# Altium project P-FTINT-2-0.PrjPCB
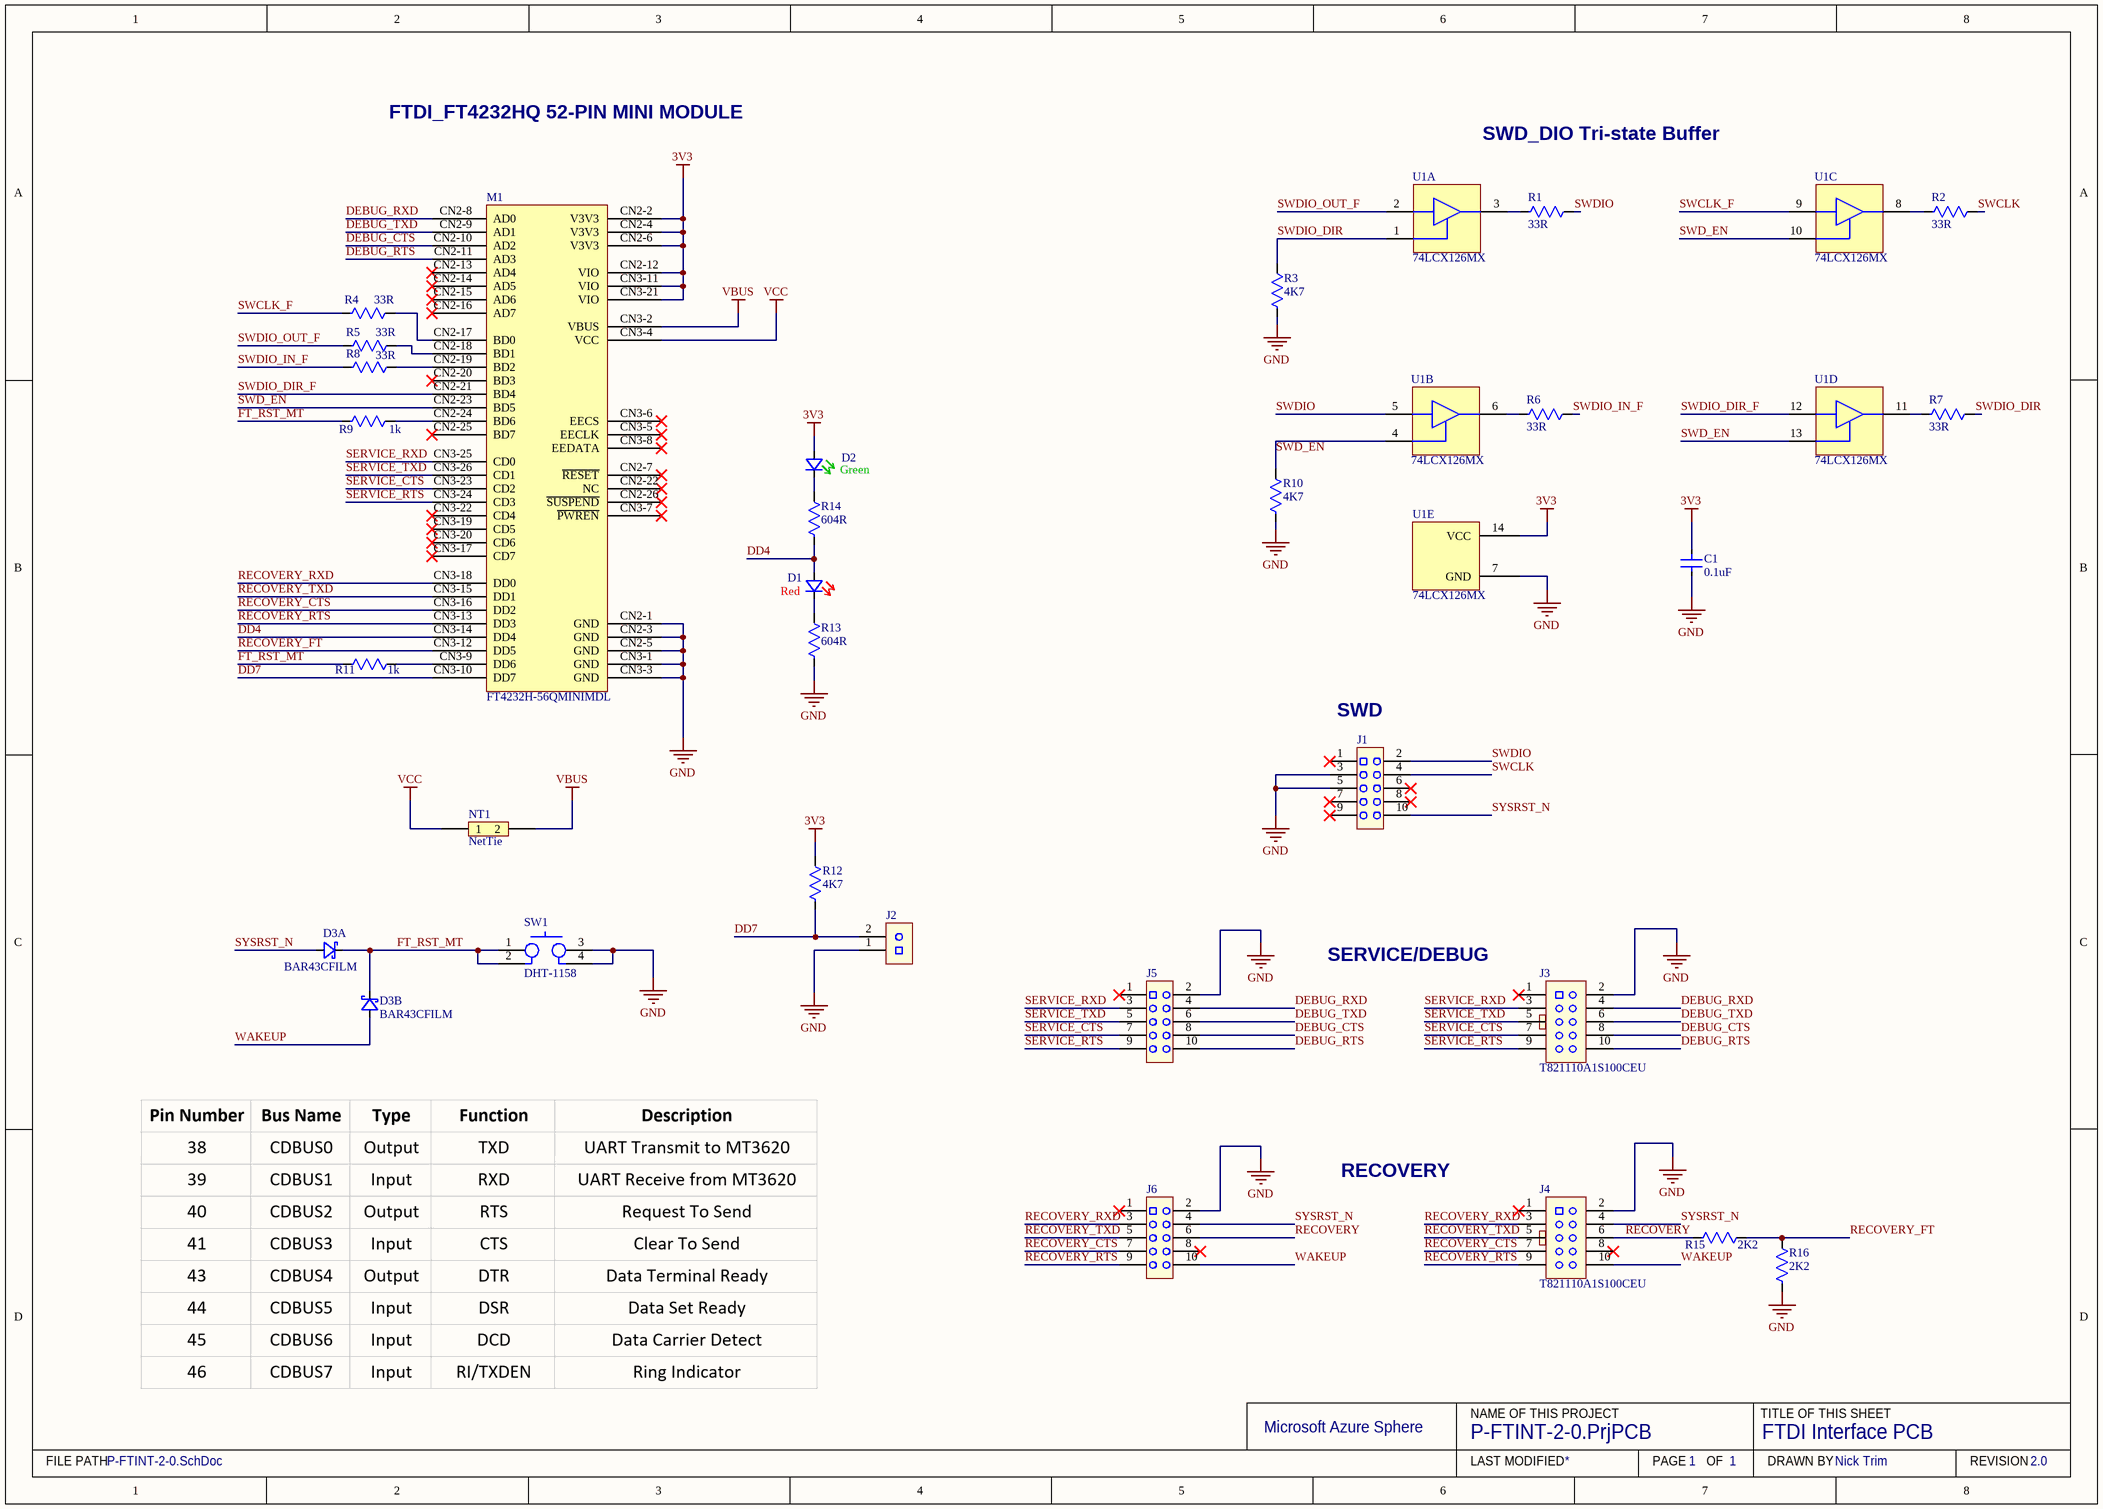
[diagram p0: P-FTINT-2-0.SchDoc]
1 sheet, 30 parts. Net scope: global (net labels, ports and power ports of the same name join across sheets).
Board file: P-FTINT-2-0.PcbDoc

## Sheet P-FTINT-2-0.SchDoc: FTDI Interface PCB
size A3; DrawnBy: Nick Trim; Revision: 2.0; SheetNumber: 1; SheetTotal: 1

### Parts
C1  0.1uF  [CAP 0603 (1608) x 1.2mm]
D1  Colour: Red  [Rohm SML-D12 Red]  (hidden comment: SML-D12U)
D2  Colour: Green  [Rohm SML-D12 Green]  (hidden comment: SML-D12P)
D3  BAR43CFILM  [ON_SEMI-SOT23-3]  (parts A,B of 2)
J1  FTSH-105-01-F-DV-K  [SAMTEC-FTSH-105-01-X-DV-K]  (value not drawn)
J2  MOLEX-0022284020  [0022284020]  (value not drawn)
J3  T821110A1S100CEU  [10 Way shrouded IDC hdr]
J4  T821110A1S100CEU  [10 Way shrouded IDC hdr]
J5  FTSH-105-01-F-DV-K  [SAMTEC-FTSH-105-01-X-DV-K]  (value not drawn)
J6  FTSH-105-01-F-DV-K  [SAMTEC-FTSH-105-01-X-DV-K]  (value not drawn)
M1  FT4232H-56QMINIMDL  [FT4232H-56Q]
NT1  NetTie  [NetTie]  (net tie, no BOM)
R1  33R  [RES0603]
R2  33R  [RES0603]
R3  4K7  [RES0603]
R4  33R  [RES0603]
R5  33R  [RES0603]
R6  33R  [RES0603]
R7  33R  [RES0603]
R8  33R  [RES0603]
R9  Resistance: 1k  [RES0603]  (hidden comment: ERJ-PA3J102V)
R10  4K7  [RES0603]
R11  Resistance: 1k  [RES0603]  (hidden comment: ERJ-PA3J102V)
R12  4K7  [RES0603]
R13  604R  [RES0603]
R14  604R  [RES0603]
R15  2K2  [RES0603]
R16  2K2  [RES0603]
SW1  DHT-1158  [DHT-1158]
U1  74LCX126MX  [74LCX126MX]  (parts A,B,C,D,E of 5)

### Nets
3V3: C1.2 D2.2(A) M1.CN2-2(V3V3) M1.CN2-4(V3V3) M1.CN2-6(V3V3) M1.CN2-12(VIO) M1.CN3-11(VIO) M1.CN3-21(VIO) R12.1 U1.14(VCC)
GND: C1.1 J1.3 J1.5 J2.1 J3.2 J4.2 J5.2 J6.2 M1.CN2-1(GND) M1.CN2-3(GND) M1.CN2-5(GND) M1.CN3-1(GND) M1.CN3-3(GND) R3.2 R10.2 R13.2 R16.2 SW1.3 SW1.4 U1.7(GND)
VBUS: M1.CN3-2(VBUS) NT1.2
VCC: M1.CN3-4(VCC) NT1.1
DD4: D1.2(A) M1.CN3-14(DD4) R14.2
DD7: J2.2 M1.CN3-10(DD7) R12.2
DEBUG_CTS: J3.8 J5.8 M1.CN2-10(AD2)
DEBUG_RTS: J3.10 J5.10 M1.CN2-11(AD3)
DEBUG_RXD: J3.4 J5.4 M1.CN2-8(AD0)
DEBUG_TXD: J3.6 J5.6 M1.CN2-9(AD1)
FT_RST_MT: D3.3(K) R9.2 R11.2 SW1.1 SW1.2
RECOVERY: J4.6 J6.6 R15.2
RECOVERY_CTS: J4.7 J6.7 M1.CN3-16(DD2)
RECOVERY_FT: M1.CN3-12(DD5) R15.1 R16.1
RECOVERY_RTS: J4.9 J6.9 M1.CN3-13(DD3)
RECOVERY_RXD: J4.3 J6.3 M1.CN3-18(DD0)
RECOVERY_TXD: J4.5 J6.5 M1.CN3-15(DD1)
SERVICE_CTS: J3.7 J5.7 M1.CN3-23(CD2)
SERVICE_RTS: J3.9 J5.9 M1.CN3-24(CD3)
SERVICE_RXD: J3.3 J5.3 M1.CN3-25(CD0)
SERVICE_TXD: J3.5 J5.5 M1.CN3-26(CD1)
SWCLK: J1.4 R2.1
SWCLK_F: R4.2 U1.9(3A)
SWD_EN: M1.CN2-23(BD5) R10.1 U1.4(2OE) U1.10(3OE) U1.13(4OE)
SWDIO: J1.2 R1.1 U1.5(2A)
SWDIO_DIR: R3.1 R7.1 U1.1(1OE)
SWDIO_DIR_F: M1.CN2-21(BD4) U1.12(4A)
SWDIO_IN_F: R6.1 R8.2
SWDIO_OUT_F: R5.2 U1.2(1A)
SYSRST_N: D3.1(A1) J1.10 J4.4 J6.4
WAKEUP: D3.2(A2) J4.10 J6.10
NetD1_1: D1.1(K) R13.1
NetD2_1: D2.1(K) R14.1
NetM1_CN2-17: M1.CN2-17(BD0) R4.1
NetM1_CN2-18: M1.CN2-18(BD1) R5.1
NetM1_CN2-19: M1.CN2-19(BD2) R8.1
NetM1_CN2-24: M1.CN2-24(BD6) R9.1
NetM1_CN3-9: M1.CN3-9(DD6) R11.1
NetR1_2: R1.2 U1.3(1Y)
NetR2_2: R2.2 U1.8(3Y)
NetR6_2: R6.2 U1.6(2Y)
NetR7_2: R7.2 U1.11(4Y)

Not connected (* = marked no-connect by the designer): J1 1* 6* 7* 8* 9*; J3 1*; J4 1* 8*; J5 1*; J6 1* 8*; M1 CN2-7(~{RESET})* CN2-13(AD4)* CN2-14(AD5)* CN2-15(AD6)* CN2-16(AD7)* CN2-20(BD3)* CN2-22(NC)* CN2-25(BD7)* CN2-26(~{SUSPEND})* CN3-5(EECLK)* CN3-6(EECS)* CN3-7(~{PWREN})* CN3-8(EEDATA)* CN3-17(CD7)* CN3-19(CD5)* CN3-20(CD6)* CN3-22(CD4)*

### Notes on the sheet
- FTDI_FT4232HQ 52-PIN MINI MODULE
- SWD_DIO Tri-state Buffer
- (near J1) SWD
- SERVICE/DEBUG
- RECOVERY
- Microsoft Azure Sphere
- NAME OF THIS PROJECT
- TITLE OF THIS SHEET
- FILE PATH
- LAST MODIFIED
- PAGE
- OF
- DRAWN BY
- REVISION

### Library data of the parts
C1 = CGA3E2X7R1E104K080AA: CAP CER 0.1UF 25V X7R 0603; Manufacturer: TDK; Capacitance: 100nF; Tolerance: 10%; Supplier 1: Digi-Key; Manufacturer Part Number: CGA3E2X7R1E104K080AA; Stock 1: 1795818; Pricing 1: 1=0.1, 10=0.057, 100=0.0253, 500=0.0181, 1000=0.01422 (USD); Mount: Surface Mount; Case/Package: 0603; Weight: 7.1E-05oz; Case Code (Metric): 1608; Case Code (Imperial): 0603; Min Operating Temperature: -55°C; Max Operating Temperature: 125°C; Packaging: Tape and Reel; Package Quantity: 1; Voltage Rating: 25V; Voltage Rating (DC): 25V; Dielectric: X7R; Termination: SMD/SMT; Composition: Ceramic; Length: 1.6mm; Height: 0.8mm; Width: 0.031inch; Thickness: 0.035inch; Depth: 0.8mm; Ratings: AEC-Q200; REACH SVHC: No SVHC; Lead Free: Lead Free; ComponentLink1URL: http://www.farnell.com/datasheets/1735392.pdf?src-supplier=Element14; ComponentLink1Description: http://www.farnell.com/datasheets/1735392.pdf?src-supplier=Element14; ComponentLink2URL: https://product.tdk.com/info/en/documents/chara_sheet/CGA3E2X7R1E104K080AA.pdf?src-supplier=Mouser; ComponentLink2Description: https://product.tdk.com/info/en/documents/chara_sheet/CGA3E2X7R1E104K080AA.pdf?src-supplier=Mouser; ComponentLink3URL: http://product.tdk.com/capacitor/mlcc/en/documents/mlccspec_automotive_general_midvoltage_en.pdf?src-supplier=Future+Electronics; ComponentLink3Description: http://product.tdk.com/capacitor/mlcc/en/documents/mlccspec_automotive_general_midvoltage_en.pdf?src-supplier=Future+Electronics; ComponentLink4URL: http://www.farnell.com/datasheets/1913358.pdf?src-supplier=Newark; ComponentLink4Description: http://www.farnell.com/datasheets/1913358.pdf?src-supplier=Newark; Supplier Part Number 1: 445-5667-1-ND
D1 = SML-D12U: 1.6 x 0.8 x 0.55mm (0603) LED 620nm Red; Manufacturer: Rohm Semiconductor; Manufacturer Part Number: SML-D12U8WT86; Millicandela Rating: 63mcd; Voltage - Forward (Vf) (Typ): 2.2V; Current - Test: 20mA; Lens Type: Diffused, White; Lens Style/Size: Rectangle with Flat Top, 1.2mm x 0.8mm; Supplier 1: Digi-Key; RoHS: RoHS Compliant; Category: Optoelectronics; Stock 1: 5722; Pricing 1: 1=0.38, 10=0.279, 25=0.2232, 100=0.1478, 250=0.1046, 500=0.08926, 1000=0.06974 (GBP); Packaging: Cut Tape (CT); Wavelength - Dominant: 620nm; Wavelength - Peak: -; Viewing Angle: -; Package / Case: 0603 (1608 Metric); Size / Dimension: 1.60mm L x 0.80mm W; Height: 0.55mm; Mounting Type: Surface Mount; Luminous Flux @ Current - Test: -; ComponentLink1URL: http://rohmfs.rohm.com/en/products/databook/datasheet/opto/led/chip_mono/sml-d1.pdf; ComponentLink1Description: http://rohmfs.rohm.com/en/products/databook/datasheet/opto/led/chip_mono/sml-d1.pdf; Supplier 2: Farnell; Supplier Part Number 1: 511-1580-1-ND; Supplier Part Number 2: 1685094
D2 = SML-D12P: 1.6 x 0.8 x 0.55mm (0603) LED 560nm Green; Manufacturer: Rohm Semiconductor; Manufacturer Part Number: SML-D12P8WT86; Millicandela Rating: 6.3mcd; Voltage - Forward (Vf) (Typ): 2.2V; Current - Test: 20mA; Lens Type: Diffused, White; Lens Style/Size: Rectangle with Flat Top, 1.2mm x 0.8mm; Supplier 1: Digi-Key; RoHS: RoHS Compliant; Category: Optoelectronics; Stock 1: 19305; Pricing 1: 1=0.38, 10=0.279, 25=0.2232, 100=0.1478, 250=0.1046, 500=0.08926, 1000=0.06974 (GBP); Packaging: Cut Tape (CT); Wavelength - Dominant: 560nm; Wavelength - Peak: -; Viewing Angle: -; Package / Case: 0603 (1608 Metric); Size / Dimension: 1.60mm L x 0.80mm W; Height: 0.55mm; Mounting Type: Surface Mount; Luminous Flux @ Current - Test: -; ComponentLink1URL: http://rohmfs.rohm.com/en/products/databook/datasheet/opto/led/chip_mono/sml-d1.pdf; ComponentLink1Description: http://rohmfs.rohm.com/en/products/databook/datasheet/opto/led/chip_mono/sml-d1.pdf; Supplier Part Number 1: 511-1579-1-ND
D3 = BAR43CFILM: Small Signal Schottky Diode, Dual Common Cathode, 30 V, 100 mA, 330 mV, 750 mA, 150 °C; Manufacturer: STMicroelectronics; Forward Current: 100mA; Max Reverse Current: 500nA; Forward Voltage: 1V; Max Repetitive Reverse Voltage (Vrrm): 30V; Reverse Recovery Time: 5ns; Max Forward Surge Current (Ifsm): 750mA; Power Dissipation: 250mW; Capacitance: 7pF; Supplier 1: Farnell; Manufacturer Part Number: BAR43CFILM; RoHS: Yes; Category: Rectifier Diodes; Stock 1: 113090; Pricing 1: 5=0.46900, 10=0.31900, 100=0.14900, 500=0.08670, 1000=0.05920 (GBP); Mount: Surface Mount; Case/Package: SOT-23; Number of Pins: 3; Weight: 0.01lb; Contact Plating: Tin,Matte; Min Operating Temperature: -65°C; Max Operating Temperature: 150°C; Element Configuration: Common Cathode; Packaging: Tape and Reel; Package Quantity: 3000; Average Rectified Current: 100mA; Termination: SMD/SMT; Peak Non-Repetitive Surge Current: 750mA; Current Rating: 100mA; Voltage Rating (DC): 30V; Max Reverse Voltage (DC): 30V; Series: BAR43; Length: 2.9mm; Width: 3.05mm; Height: 0.95mm; Radiation Hardening: No; REACH SVHC: No SVHC; Lead Free: Lead Free; RoHS Compliant: Yes; ComponentLink1URL: https://datasheet.ciiva.com/27050/869700-27050546.pdf?src-supplier=Jameco; ComponentLink1Description: https://datasheet.ciiva.com/27050/869700-27050546.pdf?src-supplier=Jameco; ComponentLink2URL: https://datasheet.ciiva.com/1199/1700360-1199952.pdf?src-supplier=Farnell; ComponentLink2Description: https://datasheet.ciiva.com/1199/1700360-1199952.pdf?src-supplier=Farnell; ComponentLink3URL: https://datasheet.ciiva.com/1199/1700360-1199953.pdf?src-supplier=Farnell; ComponentLink3Description: https://datasheet.ciiva.com/1199/1700360-1199953.pdf?src-supplier=Farnell; ComponentLink4URL: https://datasheet.ciiva.com/14558/70013844-14558997.pdf?src-supplier=Allied+Electronics; ComponentLink4Description: https://datasheet.ciiva.com/14558/70013844-14558997.pdf?src-supplier=Allied+Electronics; ComponentLink5URL: https://datasheet.ciiva.com/1177/1837092-1177592.pdf?src-supplier=Element14; ComponentLink5Description: https://datasheet.ciiva.com/1177/1837092-1177592.pdf?src-supplier=Element14; ComponentLink6URL: https://datasheet.ciiva.com/1177/1837092-1177593.pdf?src-supplier=Element14; ComponentLink6Description: https://datasheet.ciiva.com/1177/1837092-1177593.pdf?src-supplier=Element14; ComponentLink7URL: https://datasheet.ciiva.com/905/cd00000764-905866.pdf?src-supplier=Digi-Key; ComponentLink7Description: https://datasheet.ciiva.com/905/cd00000764-905866.pdf?src-supplier=Digi-Key; ComponentLink8URL: https://datasheet.ciiva.com/1177/1700360-1177594.pdf?src-supplier=Element14; ComponentLink8Description: https://datasheet.ciiva.com/1177/1700360-1177594.pdf?src-supplier=Element14; ComponentLink9URL: https://datasheet.ciiva.com/16205/cd00000764-16205466.pdf?src-supplier=Future+Electronics; ComponentLink9Description: https://datasheet.ciiva.com/16205/cd00000764-16205466.pdf?src-supplier=Future+Electronics; ComponentLink10URL: https://datasheet.ciiva.com/905/cd00000764-905867.pdf?src-supplier=Digi-Key; ComponentLink10Description: https://datasheet.ciiva.com/905/cd00000764-905867.pdf?src-supplier=Digi-Key; ComponentLink11URL: https://datasheet.ciiva.com/905/cd00000764-905868.pdf?src-supplier=Digi-Key; ComponentLink11Description: https://datasheet.ciiva.com/905/cd00000764-905868.pdf?src-supplier=Digi-Key; Supplier Part Number 1: 9801383
J1 J5 J6 = FTSH-105-01-F-DV-K: CONN HEADER 10POS DUAL .05" SMD; Manufacturer: Samtec Inc.; Connector Type: Header, Unshrouded; Number of Positions: 10; Number of Positions Loaded: All; Pitch: 0.050" (1.27mm); Supplier 1: Digi-Key; Manufacturer Part Number: FTSH-105-01-F-DV-K; RoHS: RoHS Compliant; Category: Connectors, Interconnects; Stock 1: 13304; Pricing 1: 1=2.26, 10=1.907, 50=1.647, 100=1.4737, 250=1.30032, 500=1.21362, 1000=1.12693, 2500=1.08358, 5000=1.06191 (GBP); Packaging: Tube; Contact Type: Male Pin; Number of Rows: 2; Row Spacing: 0.050" (1.27mm); Contact Mating Length: 0.120" (3.05mm); Mounting Type: Surface Mount; Termination: Solder; Fastening Type: -; Features: Keying Shroud; Contact Finish: Gold; Contact Finish Thickness: 3µin (0.08µm); Color: Black; ComponentLink1URL: http://suddendocs.samtec.com/prints/ftsh-1xx-xx-xxx-dv-xxx-mkt.pdf; ComponentLink1Description: http://suddendocs.samtec.com/prints/ftsh-1xx-xx-xxx-dv-xxx-mkt.pdf; Supplier Part Number 1: SAM8796-ND
J2 = MOLEX-0022284020: CONN HEADER 2POS .100 VERT TIN; Manufacturer: Molex, LLC; Connector Type: Header, Unshrouded, Breakaway; Number of Positions: 2; Number of Positions Loaded: All; Pitch: 0.100" (2.54mm); Supplier 1: Digi-Key; Manufacturer Part Number: 0022284020; RoHS: RoHS Compliant; Category: Connectors, Interconnects; Stock 1: 10077; Pricing 1: 1=0.12, 10=0.108, 25=0.0808, 50=0.0692, 100=0.0668, 250=0.0576, 500=0.0553 (GBP); Packaging: Bulk; Contact Type: Male Pin; Number of Rows: 1; Row Spacing: -; Contact Mating Length: 0.240" (6.10mm); Mounting Type: Through Hole; Termination: Solder; Fastening Type: -; Features: -; Contact Finish: Tin; Contact Finish Thickness: 100µin (2.54µm); Color: Black; ComponentLink1URL: http://www.molex.com/pdm_docs/sd/022284020_sd.pdf; ComponentLink1Description: http://www.molex.com/pdm_docs/sd/022284020_sd.pdf; Supplier Part Number 1: WM50014-02-ND
J3 J4 = T821110A1S100CEU: Conn Shrouded Header HDR 10 POS 2.54mm Solder ST Thru-Hole; Manufacturer: Amphenol; Max Current Rating: 3A; Contact Resistance: 20mR; Number of Contacts: 10; Gender: Male; Supplier 1: Farnell; RoHS: Yes; Category: Connectors; Contact Plating: Gold; Contact Material: Bronze,Brass; Housing Material: Polybutylene; Min Operating Temperature: -40°C; Max Operating Temperature: 105°C; Number of Rows: 2; Termination: Solder; Current Rating: 3A; Orientation: Straight; Packaging: Cut Tape; Series: T821; Length: 20.32mm; Pitch: 2.54mm; Depth: 8.95mm; REACH SVHC: No SVHC; RoHS Compliant: Yes; ComponentLink1URL: https://datasheet.ciiva.com/8045/1846058-8045255.pdf?src-supplier=Element14; ComponentLink1Description: https://datasheet.ciiva.com/8045/1846058-8045255.pdf?src-supplier=Element14; Supplier Part Number 1: 2215304; Manufacturer Part Number: T821110A1S100CEU
M1 = FT4232H-56QMINIMDL: IC MINI MODULE USB/FIFO 56QFN; Manufacturer: FTDI; Supplier 1: Farnell; Manufacturer Part Number: FT4232H-56QMINIMDL; Stock 1: 0; Pricing 1: 1=20.62 (GBP); Case/Package: Module; Min Operating Temperature: -40°C; Max Operating Temperature: 85°C; Packaging: Bulk; Features: I²C; REACH SVHC: No SVHC; Supplier Part Number 1: 2535452
R1 R2 R4-R8 = ERJ-3GEYJ330V: RES SMD 33 OHM 5% 1/10W 0603; Manufacturer: Panasonic; Power Rating: 100mW; Voltage Rating: 75V; Temperature Coefficient: 200ppm/°C; Voltage Rating (DC): 50V; Supplier 1: Digi-Key; Manufacturer Part Number: ERJ-3GEYJ330V; Stock 1: 1457212; Pricing 1: 1=0.1, 10=0.043, 100=0.0176, 1000=0.00791, 2500=0.00686 (USD); Mount: Surface Mount; Case/Package: 0603; Case Code (Imperial): 0603; Case Code (Metric): 1608; Contact Plating: Tin; Min Operating Temperature: -55°C; Max Operating Temperature: 155°C; Tolerance: 5%; Resistance: 33R; Packaging: Tape and Reel; Package Quantity: 1; Termination: SMD/SMT; Composition: Thick Film; Number of Terminations: 2; Military Standard: Not; Max Power Dissipation: 100mW; Features: Automotive AEC-Q200; Length: 1.6mm; Height: 0.45mm; Width: 0.8mm; Depth: 0.8mm; Radiation Hardening: No; REACH SVHC: No SVHC; Lead Free: Lead Free; ComponentLink1URL: http://www.mouser.com/ds/2/315/AOA0000CE1-37422.pdf?src-supplier=Mouser; ComponentLink1Description: http://www.mouser.com/ds/2/315/AOA0000CE1-37422.pdf?src-supplier=Mouser; ComponentLink2URL: https://www.verical.com/server-webapp/html/getDatasheet?partID=52004&src-supplier=Verical; ComponentLink2Description: https://www.verical.com/server-webapp/html/getDatasheet?partID=52004&src-supplier=Verical; ComponentLink3URL: http://www.farnell.com/datasheets/2059623.pdf?src-supplier=Farnell; ComponentLink3Description: http://www.farnell.com/datasheets/2059623.pdf?src-supplier=Farnell; ComponentLink4URL: http://industrial.panasonic.com/www-data/pdf/AOA0000/AOA0000CE1.pdf?src-supplier=Avnet; ComponentLink4Description: http://industrial.panasonic.com/www-data/pdf/AOA0000/AOA0000CE1.pdf?src-supplier=Avnet; ComponentLink5URL: http://www.farnell.com/datasheets/1500035.pdf?src-supplier=Element14; ComponentLink5Description: http://www.farnell.com/datasheets/1500035.pdf?src-supplier=Element14; Supplier Part Number 1: P33GCT-ND
R3 R10 R12 = ERJ-3GEYJ472V: RES SMD 4.7K OHM 5% 1/10W 0603; Manufacturer: Panasonic; Resistance: 4.7kR; Power Rating: 100mW; Voltage Rating: 75V; Temperature Coefficient: 200ppm/°C; Voltage Rating (DC): 50V; Supplier 1: Digi-Key; Manufacturer Part Number: ERJ-3GEYJ472V; Stock 1: 7744297; Pricing 1: 1=0.1, 10=0.043, 100=0.0176, 1000=0.00791, 2500=0.00686 (USD); Mount: Surface Mount; Case/Package: 0603; Case Code (Metric): 1608; Case Code (Imperial): 0603; Contact Plating: Tin; Min Operating Temperature: -55°C; Max Operating Temperature: 155°C; Packaging: Tape and Reel; Package Quantity: 1; Tolerance: 5%; Composition: Thick Film; Number of Terminations: 2; Military Standard: Not; Termination: SMD/SMT; Max Power Dissipation: 100mW; Working Voltage: 75V; Features: Automotive AEC-Q200; Length: 1.6mm; Height: 0.45mm; Width: 0.031inch; Depth: 0.8mm; Radiation Hardening: No; REACH SVHC: No SVHC; Lead Free: Lead Free; ComponentLink1URL: http://www.farnell.com/datasheets/2059623.pdf?src-supplier=Element14; ComponentLink1Description: http://www.farnell.com/datasheets/2059623.pdf?src-supplier=Element14; ComponentLink2URL: http://www.mouser.com/ds/2/315/AOA0000C84-947596.pdf?src-supplier=Mouser; ComponentLink2Description: http://www.mouser.com/ds/2/315/AOA0000C84-947596.pdf?src-supplier=Mouser; ComponentLink3URL: http://www.farnell.com/datasheets/2059623.pdf?src-supplier=Farnell; ComponentLink3Description: http://www.farnell.com/datasheets/2059623.pdf?src-supplier=Farnell; ComponentLink4URL: http://industrial.panasonic.com/www-data/pdf/AOA0000/AOA0000CE1.pdf?src-supplier=Avnet+Asia; ComponentLink4Description: http://industrial.panasonic.com/www-data/pdf/AOA0000/AOA0000CE1.pdf?src-supplier=Avnet+Asia; ComponentLink5URL: http://www.farnell.com/datasheets/1678796.pdf?src-supplier=Element14; ComponentLink5Description: http://www.farnell.com/datasheets/1678796.pdf?src-supplier=Element14; ComponentLink6URL: https://www.alliedelec.com/m/d/51cd0790071e1666bdb9d00c57fcf960.pdf?src-supplier=Allied+Electronics; ComponentLink6Description: https://www.alliedelec.com/m/d/51cd0790071e1666bdb9d00c57fcf960.pdf?src-supplier=Allied+Electronics; ComponentLink7URL: http://industrial.panasonic.com/www-data/pdf/AOA0000/AOA0000CE1.pdf?src-supplier=Avnet; ComponentLink7Description: http://industrial.panasonic.com/www-data/pdf/AOA0000/AOA0000CE1.pdf?src-supplier=Avnet; ComponentLink8URL: http://www.jameco.com/Jameco/Products/ProdDS/921942.pdf?src-supplier=Jameco; ComponentLink8Description: http://www.jameco.com/Jameco/Products/ProdDS/921942.pdf?src-supplier=Jameco; Supplier Part Number 1: P4.7KGCT-ND
R9 R11 = ERJ-PA3J102V: RES SMD 1K OHM 5% 1/10W 0603; Manufacturer: Panasonic; Max Power Dissipation: 250mW; Temperature Coefficient: 200ppm/°C; Supplier 1: Digi-Key; Manufacturer Part Number: ERJ-PA3J102V; RoHS: Yes; Category: Chip SMD Resistors; Stock 1: 12367; Pricing 1: 1=0.11000, 10=0.09800, 100=0.03750, 1000=0.01650, 2500=0.01425 (USD); Case/Package: 0603; Case Code (Imperial): 0603; Case Code (Metric): 1608; Min Operating Temperature: -55°C; Max Operating Temperature: 155°C; Tolerance: 5%; Packaging: Tape and Reel; Resistor Type: Thick Film; Number of Terminations: 2; Features: Automotive AEC-Q200; Length: 0.063inch; Width: 0.031inch; Height: 0.018inch; ComponentLink1URL: https://industrial.panasonic.com/ww/system/files/data/download/catalog/id_fixed-resistors_e_1.pdf?src-supplier=Digi-Key; ComponentLink1Description: https://industrial.panasonic.com/ww/system/files/data/download/catalog/id_fixed-resistors_e_1.pdf?src-supplier=Digi-Key
R13 R14 = ERJ-3EKF6040V: RES SMD 604 OHM 1% 1/10W 0603; Manufacturer: Panasonic; Power Rating: 100mW; Voltage Rating: 75V; Temperature Coefficient: 100ppm/°C; Voltage Rating (DC): 50V; Supplier 1: Digi-Key; Manufacturer Part Number: ERJ-3EKF6040V; Stock 1: 478130; Pricing 1: 1=0.1, 10=0.065, 100=0.0264, 1000=0.01186, 2500=0.01029 (USD); Mount: Surface Mount; Case/Package: 0603; Weight: 7.1E-05oz; Case Code (Metric): 1608; Case Code (Imperial): 0603; Contact Plating: Tin; Min Operating Temperature: -55°C; Max Operating Temperature: 155°C; Resistance: 604R; Tolerance: 1%; Packaging: Tape and Reel; Package Quantity: 1; Composition: Thick Film; Number of Terminations: 2; Termination: SMD/SMT; Military Standard: Not; Max Power Dissipation: 100mW; Features: Automotive AEC-Q200; Length: 1.6mm; Height: 0.45mm; Width: 0.031inch; Depth: 0.8mm; Radiation Hardening: No; REACH SVHC: No SVHC; Lead Free: Lead Free; ComponentLink1URL: http://www.jameco.com/Jameco/Products/ProdDS/1988284.pdf?src-supplier=Jameco; ComponentLink1Description: http://www.jameco.com/Jameco/Products/ProdDS/1988284.pdf?src-supplier=Jameco; ComponentLink2URL: http://www.farnell.com/datasheets/1678782.pdf?src-supplier=Element14; ComponentLink2Description: http://www.farnell.com/datasheets/1678782.pdf?src-supplier=Element14; ComponentLink3URL: https://www.alliedelec.com/m/d/623f45ff1957d936ff56d46fd1c28cac.pdf?src-supplier=Allied+Electronics; ComponentLink3Description: https://www.alliedelec.com/m/d/623f45ff1957d936ff56d46fd1c28cac.pdf?src-supplier=Allied+Electronics; ComponentLink4URL: http://www.onlinecomponents.com/productFiles/mf-PSC/aoa0000ce2.pdf?src-supplier=Onlinecomponents.com; ComponentLink4Description: http://www.onlinecomponents.com/productFiles/mf-PSC/aoa0000ce2.pdf?src-supplier=Onlinecomponents.com; ComponentLink5URL: http://www.mouser.com/ds/2/315/AOA0000C304-1149620.pdf?src-supplier=Mouser; ComponentLink5Description: http://www.mouser.com/ds/2/315/AOA0000C304-1149620.pdf?src-supplier=Mouser; ComponentLink6URL: http://www.farnell.com/datasheets/1911175.pdf?src-supplier=Farnell; ComponentLink6Description: http://www.farnell.com/datasheets/1911175.pdf?src-supplier=Farnell; ComponentLink7URL: http://www.farnell.com/datasheets/426256.pdf?src-supplier=Element14; ComponentLink7Description: http://www.farnell.com/datasheets/426256.pdf?src-supplier=Element14; Supplier Part Number 1: P604HCT-ND
R15 R16 = ERJ-3GEYJ222V: RES SMD 2.2K OHM 5% 1/10W 0603; Manufacturer: Panasonic; Resistance: 2.2kR; Power Rating: 100mW; Voltage Rating: 75V; Temperature Coefficient: 200ppm/°C; Voltage Rating (DC): 50V; Supplier 1: Digi-Key; Manufacturer Part Number: ERJ-3GEYJ222V; Stock 1: 4299124; Pricing 1: 1=0.1, 10=0.043, 100=0.0176, 1000=0.00791, 2500=0.00686 (USD); Mount: Surface Mount; Case/Package: 0603; Case Code (Imperial): 0603; Case Code (Metric): 1608; Contact Plating: Tin; Min Operating Temperature: -55°C; Max Operating Temperature: 155°C; Package Quantity: 1; Packaging: Tape and Reel; Tolerance: 5%; Composition: Thick Film; Number of Terminations: 2; Military Standard: Not; Termination: SMD/SMT; Max Power Dissipation: 100mW; Features: Automotive AEC-Q200; Working Voltage: 75V; Length: 1.6mm; Height: 0.45mm; Width: 0.8mm; Depth: 0.8mm; Radiation Hardening: No; REACH SVHC: No SVHC; Lead Free: Lead Free; ComponentLink1URL: https://www.alliedelec.com/m/d/51cd0790071e1666bdb9d00c57fcf960.pdf?src-supplier=Allied+Electronics; ComponentLink1Description: https://www.alliedelec.com/m/d/51cd0790071e1666bdb9d00c57fcf960.pdf?src-supplier=Allied+Electronics; ComponentLink2URL: http://industrial.panasonic.com/www-data/pdf/AOA0000/AOA0000CE1.pdf?src-supplier=Avnet; ComponentLink2Description: http://industrial.panasonic.com/www-data/pdf/AOA0000/AOA0000CE1.pdf?src-supplier=Avnet; ComponentLink3URL: http://www.farnell.com/datasheets/2059623.pdf?src-supplier=Element14; ComponentLink3Description: http://www.farnell.com/datasheets/2059623.pdf?src-supplier=Element14; ComponentLink4URL: https://industrial.panasonic.com/cdbs/www-data/pdf/RDA0000/AOA0000C301.pdf?src-supplier=Future+Electronics; ComponentLink4Description: https://industrial.panasonic.com/cdbs/www-data/pdf/RDA0000/AOA0000C301.pdf?src-supplier=Future+Electronics; ComponentLink5URL: http://www.jameco.com/Jameco/Products/ProdDS/1988639.pdf?src-supplier=Jameco; ComponentLink5Description: http://www.jameco.com/Jameco/Products/ProdDS/1988639.pdf?src-supplier=Jameco; ComponentLink6URL: http://industrial.panasonic.com/www-data/pdf/AOA0000/AOA0000CE1.pdf?src-supplier=Avnet+Europe; ComponentLink6Description: http://industrial.panasonic.com/www-data/pdf/AOA0000/AOA0000CE1.pdf?src-supplier=Avnet+Europe; ComponentLink7URL: http://www.farnell.com/datasheets/2059623.pdf?src-supplier=Farnell; ComponentLink7Description: http://www.farnell.com/datasheets/2059623.pdf?src-supplier=Farnell; ComponentLink8URL: http://www.farnell.com/datasheets/1678796.pdf?src-supplier=Element14; ComponentLink8Description: http://www.farnell.com/datasheets/1678796.pdf?src-supplier=Element14; Supplier Part Number 1: P2.2KGCT-ND
U1 = 74LCX126MX: Buffers & Line Drivers LV Quad Buffer 5V Tolerant I/O; Manufacturer: ON Semiconductor / Fairchild; Max Supply Voltage: 3.6V; Min Supply Voltage: 2V; Propagation Delay: 5.5ns; Number of Channels: 4; Logic Function: Buffer,Inverting; Low Level Output Current: 24mA; Number of Output Lines: 3; Polarity: Non-Inverting; Number of Bits per Element: 1; High Level Output Current: -24mA; Turn-On Delay Time: 7.8ns; Quiescent Current: 10uA; Schmitt Trigger Input: No; Supplier 1: Digi-Key; Manufacturer Part Number: 74LCX126MX; Stock 1: 0; Mount: Surface Mount; Case/Package: SOIC; Number of Pins: 14; Weight: 0.15g; Contact Plating: Tin,Matte; Min Operating Temperature: -40°C; Max Operating Temperature: 85°C; Package Quantity: 2500; Packaging: Tape and Reel; Number of Inputs: 4; Number of Outputs: 4; Number of Elements: 4; Number of Input Lines: 4; Number of Bits: 4; Length: 8.75mm; Height: 1.5mm; Width: 4mm; Radiation Hardening: No; Lead Free: Lead Free; ComponentLink1URL: http://www.mouser.com/ds/2/149/74LCX126-106501.pdf?src-supplier=Mouser; ComponentLink1Description: http://www.mouser.com/ds/2/149/74LCX126-106501.pdf?src-supplier=Mouser; ComponentLink2URL: http://www.fairchildsemi.com/datasheets/74/74LCX126.pdf?src-supplier=Digi-Key; ComponentLink2Description: http://www.fairchildsemi.com/datasheets/74/74LCX126.pdf?src-supplier=Digi-Key; ComponentLink3URL: https://www.fairchildsemi.com/datasheets/74/74LCX126.pdf?src-supplier=Avnet; ComponentLink3Description: https://www.fairchildsemi.com/datasheets/74/74LCX126.pdf?src-supplier=Avnet; ComponentLink4URL: http://www.produktinfo.conrad.com/datenblaetter/1200000-1299999/001251913-da-01-en-IC_BUFFER_QUAD_LV_74LCX126MX_SOIC_14_FSC.pdf?src-supplier=Conrad; ComponentLink4Description: http://www.produktinfo.conrad.com/datenblaetter/1200000-1299999/001251913-da-01-en-IC_BUFFER_QUAD_LV_74LCX126MX_SOIC_14_FSC.pdf?src-supplier=Conrad; Supplier Part Number 1: 74LCX126MX-ND